# Altium project MainBoardPE2.PrjPcb
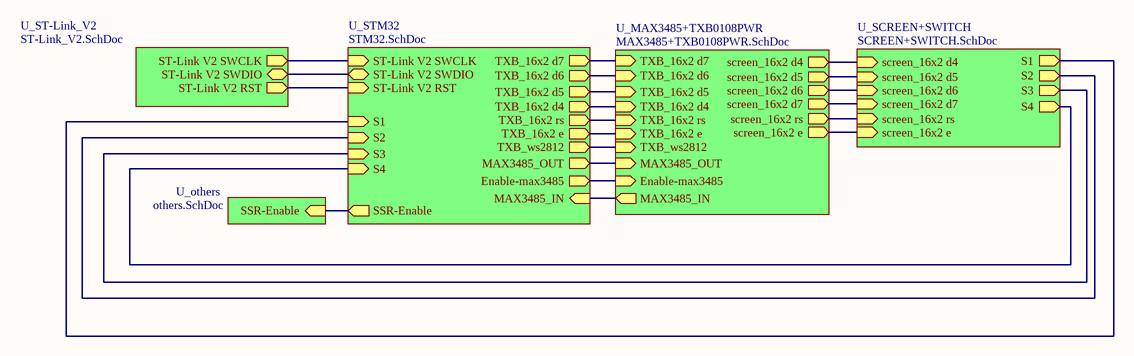
[diagram p0: TOP.SchDoc]
6 sheets, 40 parts. Net scope: hierarchical (ports join the sheet entries above them; power ports are global).
Board file: MainBoard.PcbDoc
Sheets:
  TOP.SchDoc
    U_STM32 = STM32.SchDoc
    U_ST-Link_V2 = ST-Link_V2.SchDoc
    U_SCREEN+SWITCH = SCREEN+SWITCH.SchDoc
    U_others = others.SchDoc
    U_MAX3485+TXB0108PWR = MAX3485+TXB0108PWR.SchDoc

## Sheet TOP.SchDoc
size A4; SheetNumber: 1; SheetTotal: 6

### Sub-sheets
U_MAX3485+TXB0108PWR = MAX3485+TXB0108PWR.SchDoc: Enable-max3485 (in), screen_16x2 d4 (out), screen_16x2 d5 (out), screen_16x2 d6 (out), screen_16x2 d7 (out), screen_16x2 rs (out), screen_16x2 e (out), TXB_16x2 d4 (in), TXB_16x2 d5 (in), TXB_16x2 d6 (in), TXB_16x2 d7 (in), TXB_16x2 rs (in), TXB_16x2 e (in), TXB_ws2812 (in), MAX3485_OUT (in), MAX3485_IN (out)
U_others = others.SchDoc: SSR-Enable (in)
U_SCREEN+SWITCH = SCREEN+SWITCH.SchDoc: screen_16x2 d4 (in), screen_16x2 d5 (in), screen_16x2 d6 (in), screen_16x2 d7 (in), screen_16x2 e (in), S4 (out), S1 (out), S2 (out), S3 (out), screen_16x2 rs (in)
U_ST-Link_V2 = ST-Link_V2.SchDoc: ST-Link V2 SWDIO (bidir), ST-Link V2 SWCLK (out), ST-Link V2 RST (out)
U_STM32 = STM32.SchDoc: ST-Link V2 SWCLK (in), ST-Link V2 SWDIO (bidir), TXB_16x2 d7 (out), ST-Link V2 RST (in), Enable-max3485 (out), TXB_16x2 d4 (out), TXB_16x2 d5 (out), TXB_16x2 d6 (out), TXB_16x2 rs (out), TXB_16x2 e (out), S2 (in), S3 (in), S4 (in), S1 (in), SSR-Enable (out), TXB_ws2812 (out), MAX3485_IN (in), MAX3485_OUT (out)

### Nets
NetH1_1: sheet U_STM32/ST-Link V2 RST, sheet U_ST-Link_V2/ST-Link V2 RST
NetH1_2: sheet U_STM32/ST-Link V2 SWDIO, sheet U_ST-Link_V2/ST-Link V2 SWDIO
NetH1_4: sheet U_STM32/ST-Link V2 SWCLK, sheet U_ST-Link_V2/ST-Link V2 SWCLK
NetIC1_12: sheet U_STM32/SSR-Enable, sheet U_others/SSR-Enable
NetIC1_13: sheet U_STM32/S1, sheet U_SCREEN+SWITCH/S1
NetIC1_14: sheet U_STM32/S2, sheet U_SCREEN+SWITCH/S2
NetIC1_15: sheet U_STM32/S3, sheet U_SCREEN+SWITCH/S3
NetIC1_16: sheet U_STM32/S4, sheet U_SCREEN+SWITCH/S4
NetIC1_30: sheet U_STM32/MAX3485_OUT, sheet U_MAX3485+TXB0108PWR/MAX3485_OUT
NetIC1_31: sheet U_STM32/MAX3485_IN, sheet U_MAX3485+TXB0108PWR/MAX3485_IN
NetIC1_32: sheet U_STM32/Enable-max3485, sheet U_MAX3485+TXB0108PWR/Enable-max3485
NetIC1_39: sheet U_STM32/TXB_ws2812, sheet U_MAX3485+TXB0108PWR/TXB_ws2812
NetIC1_40: sheet U_STM32/TXB_16x2 d7, sheet U_MAX3485+TXB0108PWR/TXB_16x2 d7
NetIC1_41: sheet U_STM32/TXB_16x2 d6, sheet U_MAX3485+TXB0108PWR/TXB_16x2 d6
NetIC1_42: sheet U_STM32/TXB_16x2 d5, sheet U_MAX3485+TXB0108PWR/TXB_16x2 d5
NetIC1_43: sheet U_STM32/TXB_16x2 d4, sheet U_MAX3485+TXB0108PWR/TXB_16x2 d4
NetIC1_45: sheet U_STM32/TXB_16x2 e, sheet U_MAX3485+TXB0108PWR/TXB_16x2 e
NetIC1_46: sheet U_STM32/TXB_16x2 rs, sheet U_MAX3485+TXB0108PWR/TXB_16x2 rs
NetIC3_13: sheet U_SCREEN+SWITCH/screen_16x2 d7, sheet U_MAX3485+TXB0108PWR/screen_16x2 d7
NetIC3_14: sheet U_SCREEN+SWITCH/screen_16x2 d6, sheet U_MAX3485+TXB0108PWR/screen_16x2 d6
NetIC3_15: sheet U_SCREEN+SWITCH/screen_16x2 d5, sheet U_MAX3485+TXB0108PWR/screen_16x2 d5
NetIC3_16: sheet U_SCREEN+SWITCH/screen_16x2 d4, sheet U_MAX3485+TXB0108PWR/screen_16x2 d4
NetIC3_17: sheet U_SCREEN+SWITCH/screen_16x2 e, sheet U_MAX3485+TXB0108PWR/screen_16x2 e
NetIC3_18: sheet U_SCREEN+SWITCH/screen_16x2 rs, sheet U_MAX3485+TXB0108PWR/screen_16x2 rs

## Sheet STM32.SchDoc
size A4; SheetNumber: 2; SheetTotal: 6
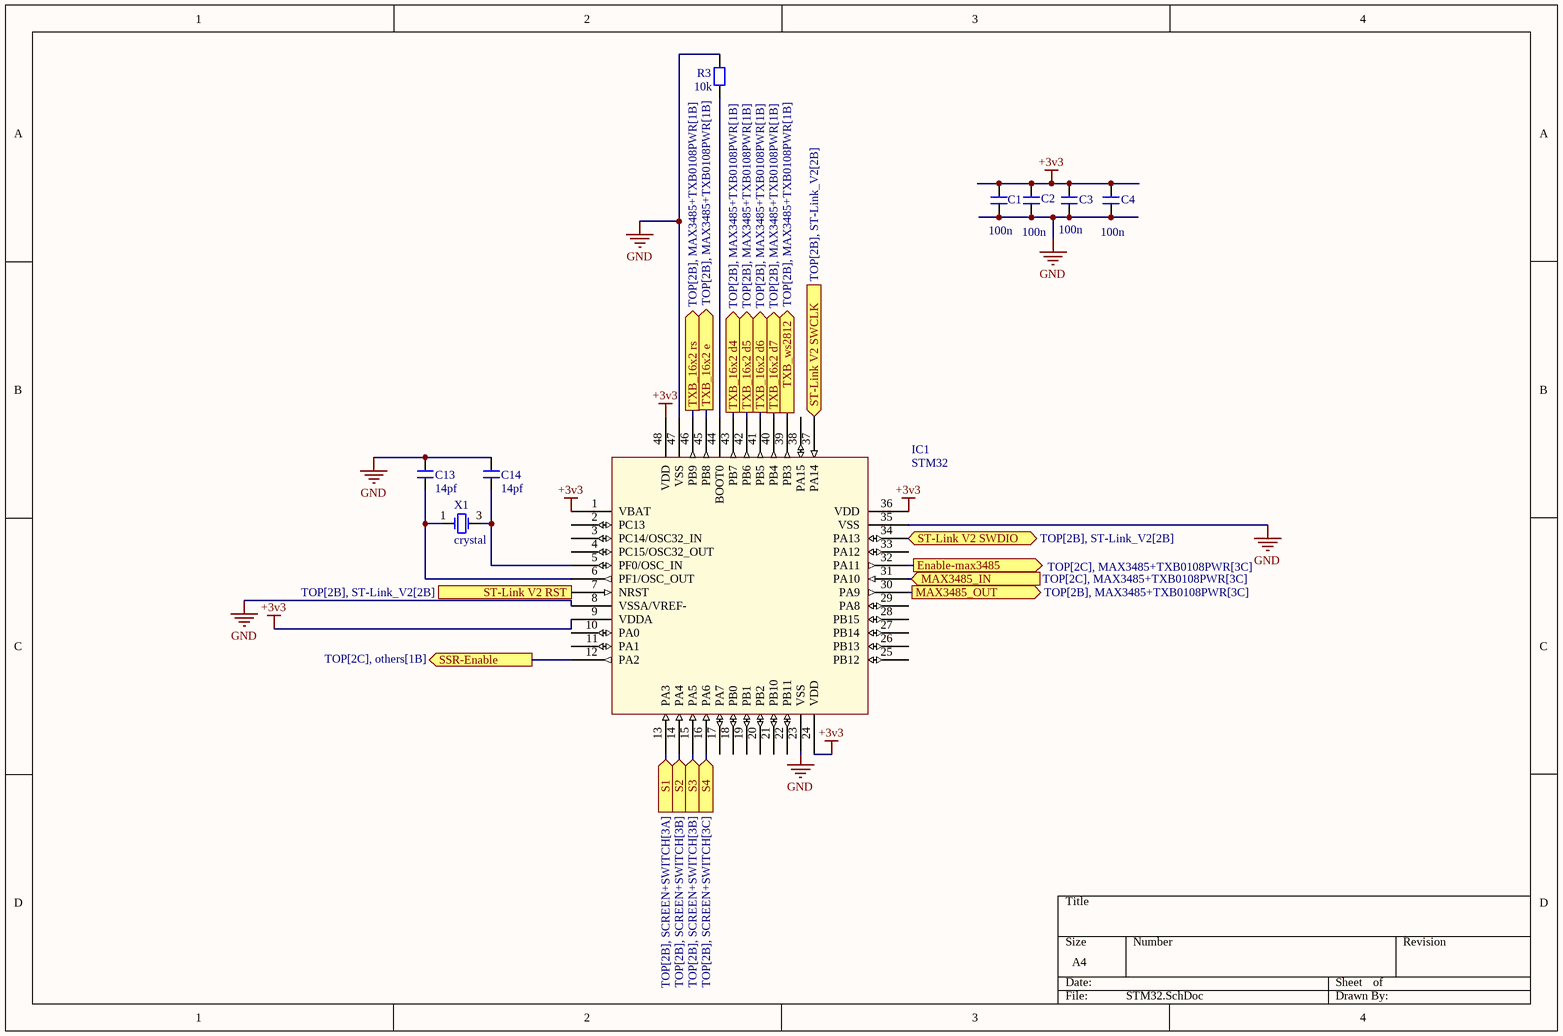
[diagram p1: STM32.SchDoc]

### Parts
C1  100n  [0805]
C2  100n  [0805]
C3  100n  [0805]
C4  100n  [0805]
C13  14pf  [0805]
C14  14pf  [0805]
IC1  STM32  [STM32]
R3  10k  [0805]
X1  crystal  [crystal]

### Ports
Enable-max3485 (out, see TOP[2C], MAX3485+TXB0108PWR[3C]), MAX3485_IN (in, see TOP[2C], MAX3485+TXB0108PWR[3C]), MAX3485_OUT (out, see TOP[2B], MAX3485+TXB0108PWR[3C]), S1 (in, see TOP[2B], SCREEN+SWITCH[3A]), S2 (in, see TOP[2B], SCREEN+SWITCH[3B]), S3 (in, see TOP[2B], SCREEN+SWITCH[3B]), S4 (in, see TOP[2B], SCREEN+SWITCH[3C]), SSR-Enable (out, see TOP[2C], others[1B]), ST-Link V2 RST (in, see TOP[2B], ST-Link_V2[2B]), ST-Link V2 SWCLK (in, see TOP[2B], ST-Link_V2[2B]), ST-Link V2 SWDIO (bidir, see TOP[2B], ST-Link_V2[2B]), TXB_16x2 d4 (out, see TOP[2B], MAX3485+TXB0108PWR[1B]), TXB_16x2 d5 (out, see TOP[2B], MAX3485+TXB0108PWR[1B]), TXB_16x2 d6 (out, see TOP[2B], MAX3485+TXB0108PWR[1B]), TXB_16x2 d7 (out, see TOP[2B], MAX3485+TXB0108PWR[1B]), TXB_16x2 e (out, see TOP[2B], MAX3485+TXB0108PWR[1B]), TXB_16x2 rs (out, see TOP[2B], MAX3485+TXB0108PWR[1B]), TXB_ws2812 (out, see TOP[2B], MAX3485+TXB0108PWR[1B])

### Nets
+3v3: C1.1 C2.1 C3.1 C4.1 IC1.1(VBAT) IC1.9(VDDA) IC1.24(VDD) IC1.36(VDD) IC1.48(VDD)
GND: C1.2 C2.2 C3.2 C4.2 C13.1 C14.1 IC1.8(VSSA/VREF-) IC1.23(VSS) IC1.35(VSS) IC1.47(VSS) R3.1
NetC13_2: C13.2 IC1.6(PF1/OSC_OUT) X1.1(OSC1)
NetC14_2: C14.2 IC1.5(PF0/OSC_IN) X1.3(OSC2)
NetH1_1: IC1.7(NRST) ; port ST-Link V2 RST
NetH1_2: IC1.34(PA13) ; port ST-Link V2 SWDIO
NetH1_4: IC1.37(PA14) ; port ST-Link V2 SWCLK
NetIC1_12: IC1.12(PA2) ; port SSR-Enable
NetIC1_13: IC1.13(PA3) ; port S1
NetIC1_14: IC1.14(PA4) ; port S2
NetIC1_15: IC1.15(PA5) ; port S3
NetIC1_16: IC1.16(PA6) ; port S4
NetIC1_30: IC1.30(PA9) ; port MAX3485_OUT
NetIC1_31: IC1.31(PA10) ; port MAX3485_IN
NetIC1_32: IC1.32(PA11) ; port Enable-max3485
NetIC1_39: IC1.39(PB3) ; port TXB_ws2812
NetIC1_40: IC1.40(PB4) ; port TXB_16x2 d7
NetIC1_41: IC1.41(PB5) ; port TXB_16x2 d6
NetIC1_42: IC1.42(PB6) ; port TXB_16x2 d5
NetIC1_43: IC1.43(PB7) ; port TXB_16x2 d4
NetIC1_44: IC1.44(BOOT0) R3.2
NetIC1_45: IC1.45(PB8) ; port TXB_16x2 e
NetIC1_46: IC1.46(PB9) ; port TXB_16x2 rs

Not connected (* = marked no-connect by the designer): IC1 2(PC13) 3(PC14/OSC32_IN) 4(PC15/OSC32_OUT) 10(PA0) 11(PA1) 17(PA7) 18(PB0) 19(PB1) 20(PB2) 21(PB10) 22(PB11) 25(PB12) 26(PB13) 27(PB14) 28(PB15) 29(PA8) 33(PA12) 38(PA15)

### Library data of the parts
C1-C4 C13 C14 = capacitor
R3 = resistor

## Sheet ST-Link_V2.SchDoc
size A4; SheetNumber: 3; SheetTotal: 6
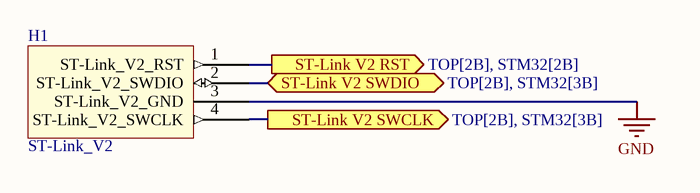
[diagram p2: ST-Link_V2.SchDoc]

### Parts
H1  ST-Link_V2  [4pin]

### Ports
ST-Link V2 RST (out, see TOP[2B], STM32[2B]), ST-Link V2 SWCLK (out, see TOP[2B], STM32[3B]), ST-Link V2 SWDIO (bidir, see TOP[2B], STM32[3B])

### Nets
GND: H1.3(ST-Link_V2_GND)
NetH1_1: H1.1(ST-Link_V2_RST) ; port ST-Link V2 RST
NetH1_2: H1.2(ST-Link_V2_SWDIO) ; port ST-Link V2 SWDIO
NetH1_4: H1.4(ST-Link_V2_SWCLK) ; port ST-Link V2 SWCLK

## Sheet SCREEN+SWITCH.SchDoc
size A4; SheetNumber: 5; SheetTotal: 6
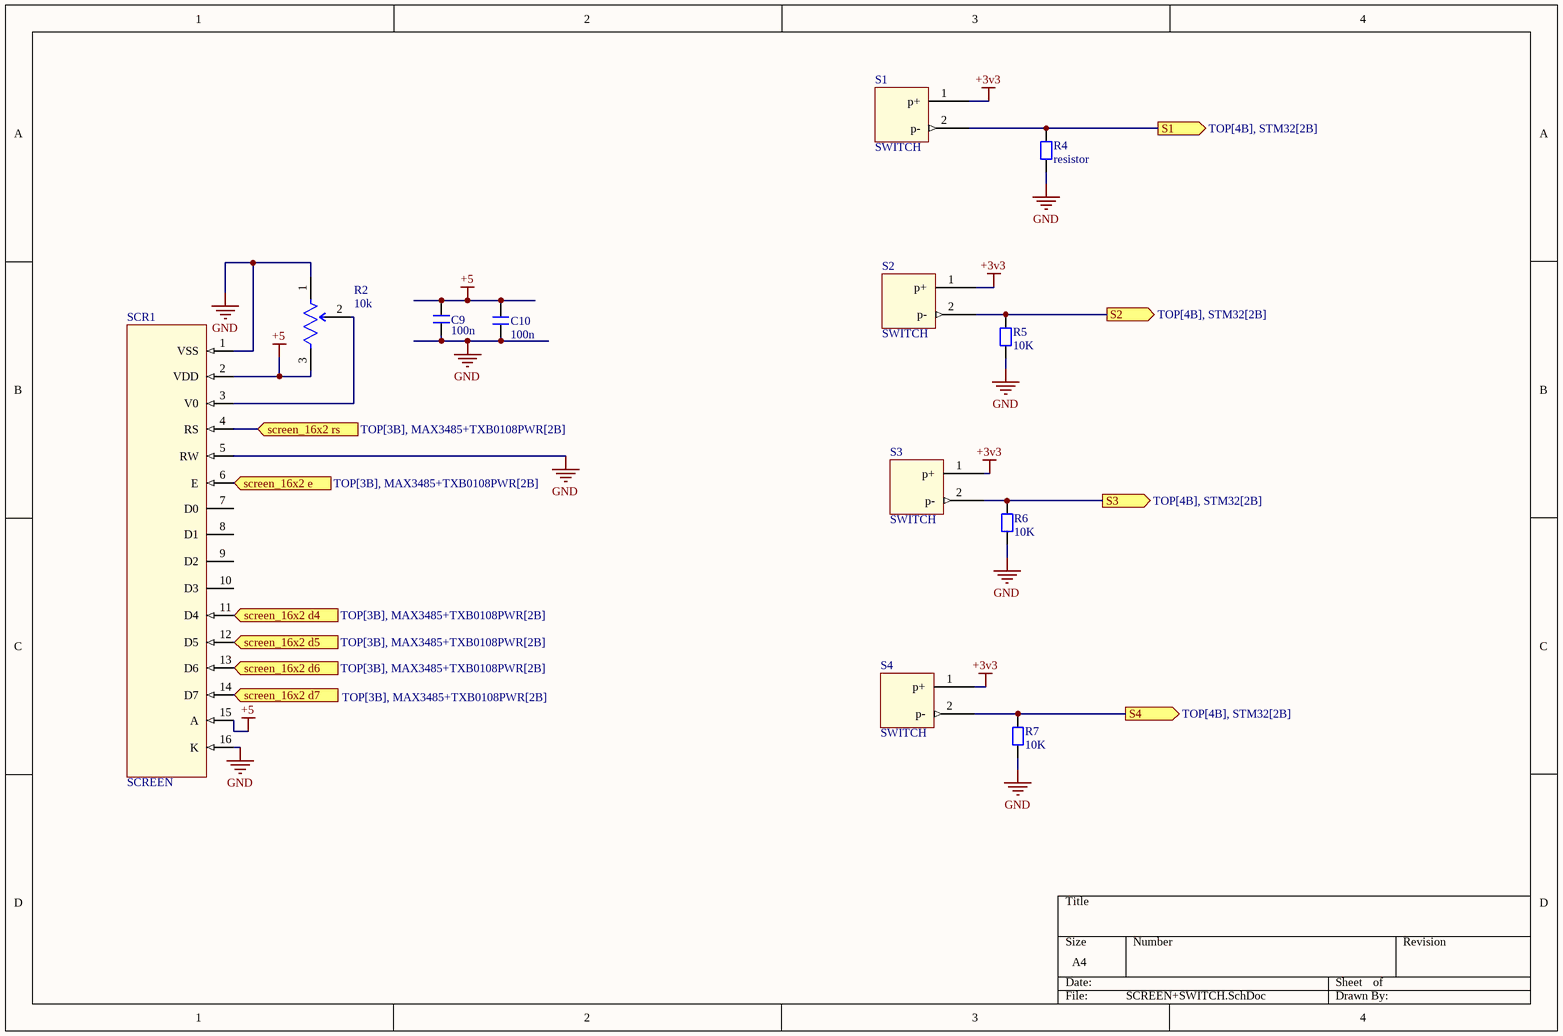
[diagram p3: SCREEN+SWITCH.SchDoc]

### Parts
C9  100n  [0805]
C10  100n  [0805]
R2  10k  [potentiometer]
R4  resistor  [0805]
R5  10K  [0805]
R6  10K  [0805]
R7  10K  [0805]
S1  SWITCH  [SWITCh]
S2  SWITCH  [SWITCh]
S3  SWITCH  [SWITCh]
S4  SWITCH  [SWITCh]
SCR1  SCREEN  [SCREEN]

### Ports
S1 (out, see TOP[4B], STM32[2B]), S2 (out, see TOP[4B], STM32[2B]), S3 (out, see TOP[4B], STM32[2B]), S4 (out, see TOP[4B], STM32[2B]), screen_16x2 d4 (in, see TOP[3B], MAX3485+TXB0108PWR[2B]), screen_16x2 d5 (in, see TOP[3B], MAX3485+TXB0108PWR[2B]), screen_16x2 d6 (in, see TOP[3B], MAX3485+TXB0108PWR[2B]), screen_16x2 d7 (in, see TOP[3B], MAX3485+TXB0108PWR[2B]), screen_16x2 e (in, see TOP[3B], MAX3485+TXB0108PWR[2B]), screen_16x2 rs (in, see TOP[3B], MAX3485+TXB0108PWR[2B])

### Nets
+3v3: S1.1(p+) S2.1(p+) S3.1(p+) S4.1(p+)
+5: C9.1 C10.1 R2.3(CW) SCR1.2(VDD) SCR1.15(A)
GND: C9.2 C10.2 R2.1(CCW) R4.2 R5.2 R6.2 R7.2 SCR1.1(VSS) SCR1.5(RW) SCR1.16(K)
NetIC1_13: R4.1 S1.2(p-) ; port S1
NetIC1_14: R5.1 S2.2(p-) ; port S2
NetIC1_15: R6.1 S3.2(p-) ; port S3
NetIC1_16: R7.1 S4.2(p-) ; port S4
NetIC3_13: SCR1.14(D7) ; port screen_16x2 d7
NetIC3_14: SCR1.13(D6) ; port screen_16x2 d6
NetIC3_15: SCR1.12(D5) ; port screen_16x2 d5
NetIC3_16: SCR1.11(D4) ; port screen_16x2 d4
NetIC3_17: SCR1.6(E) ; port screen_16x2 e
NetIC3_18: SCR1.4(RS) ; port screen_16x2 rs
NetR2_2: R2.2(WIPER) SCR1.3(V0)

Not connected (* = marked no-connect by the designer): SCR1 7(D0) 8(D1) 9(D2) 10(D3)

### Library data of the parts
C9 C10 = capacitor
R2 = potentiometer
R5-R7 = resistor

## Sheet others.SchDoc
size A4; SheetNumber: 6; SheetTotal: 6
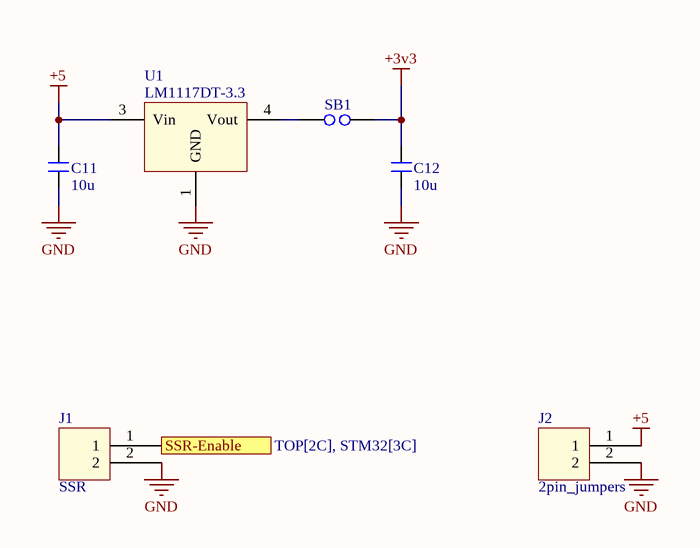
[diagram p4: others.SchDoc]

### Parts
C11  10u  [0805]
C12  10u  [0805]
J1  SSR  [2pin]
J2  2pin_jumpers  [2pinpwd]
SB1  SolderBrige  [SolderBrige]  (value not drawn)
U1  LM1117DT-3.3  [LM1117DT-3.3]

### Ports
SSR-Enable (in, see TOP[2C], STM32[3C])

### Nets
+3v3: C12.1 SB1.1
+5: C11.1 J2.1 U1.3(Vin)
GND: C11.2 C12.2 J1.2 J2.2 U1.1(GND)
NetIC1_12: J1.1 ; port SSR-Enable
NetSB1_2: SB1.2 U1.4(Vout)

### Library data of the parts
C11 C12 = capacitor

## Sheet MAX3485+TXB0108PWR.SchDoc
size A4; SheetNumber: 4; SheetTotal: 6
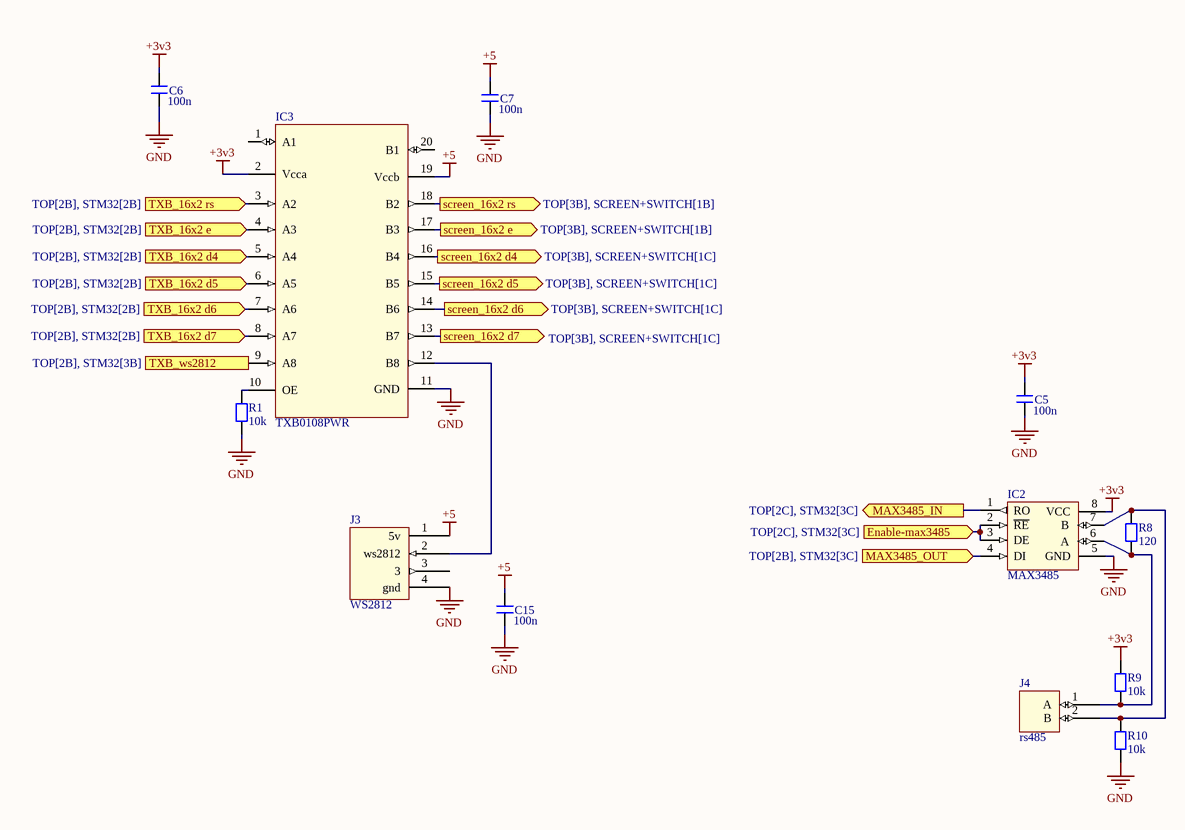
[diagram p5: MAX3485+TXB0108PWR.SchDoc]

### Parts
C5  100n  [0805]
C6  100n  [0805]
C7  100n  [0805]
C15  100n  [0805]
IC2  MAX3485  [MAX3485]
IC3  TXB0108PWR  [TXB0108PWR]
J3  WS2812  [4pinpwd]
J4  rs485  [2pin]
R1  10k  [0805]
R8  120  [0805]
R9  10k  [0805]
R10  10k  [0805]

### Ports
Enable-max3485 (in, see TOP[2C], STM32[3C]), MAX3485_IN (out, see TOP[2C], STM32[3C]), MAX3485_OUT (in, see TOP[2B], STM32[3C]), screen_16x2 d4 (out, see TOP[3B], SCREEN+SWITCH[1C]), screen_16x2 d5 (out, see TOP[3B], SCREEN+SWITCH[1C]), screen_16x2 d6 (out, see TOP[3B], SCREEN+SWITCH[1C]), screen_16x2 d7 (out, see TOP[3B], SCREEN+SWITCH[1C]), screen_16x2 e (out, see TOP[3B], SCREEN+SWITCH[1B]), screen_16x2 rs (out, see TOP[3B], SCREEN+SWITCH[1B]), TXB_16x2 d4 (in, see TOP[2B], STM32[2B]), TXB_16x2 d5 (in, see TOP[2B], STM32[2B]), TXB_16x2 d6 (in, see TOP[2B], STM32[2B]), TXB_16x2 d7 (in, see TOP[2B], STM32[2B]), TXB_16x2 e (in, see TOP[2B], STM32[2B]), TXB_16x2 rs (in, see TOP[2B], STM32[2B]), TXB_ws2812 (in, see TOP[2B], STM32[3B])

### Nets
+3v3: C5.1 C6.1 IC2.8(VCC) IC3.2(Vcca) R9.1
+5: C7.1 C15.1 IC3.19(Vccb) J3.1(5v)
GND: C5.2 C6.2 C7.2 C15.2 IC2.5(GND) IC3.11(GND) J3.4(gnd) R1.2 R10.2
NetIC1_30: IC2.4(DI) ; port MAX3485_OUT
NetIC1_31: IC2.1(RO) ; port MAX3485_IN
NetIC1_32: IC2.2(~{RE}) IC2.3(DE) ; port Enable-max3485
NetIC1_39: IC3.9(A8) ; port TXB_ws2812
NetIC1_40: IC3.8(A7) ; port TXB_16x2 d7
NetIC1_41: IC3.7(A6) ; port TXB_16x2 d6
NetIC1_42: IC3.6(A5) ; port TXB_16x2 d5
NetIC1_43: IC3.5(A4) ; port TXB_16x2 d4
NetIC1_45: IC3.4(A3) ; port TXB_16x2 e
NetIC1_46: IC3.3(A2) ; port TXB_16x2 rs
NetIC2_6: IC2.6(A) J4.1(A) R8.2 R9.2
NetIC2_7: IC2.7(B) J4.2(B) R8.1 R10.1
NetIC3_10: IC3.10(OE) R1.1
NetIC3_12: IC3.12(B8) J3.2(ws2812)
NetIC3_13: IC3.13(B7) ; port screen_16x2 d7
NetIC3_14: IC3.14(B6) ; port screen_16x2 d6
NetIC3_15: IC3.15(B5) ; port screen_16x2 d5
NetIC3_16: IC3.16(B4) ; port screen_16x2 d4
NetIC3_17: IC3.17(B3) ; port screen_16x2 e
NetIC3_18: IC3.18(B2) ; port screen_16x2 rs

Not connected (* = marked no-connect by the designer): IC3 1(A1) 20(B1); J3 3

### Library data of the parts
C5-C7 C15 = capacitor
R1 R8-R10 = resistor

## Nets that join several sheets
+3v3: STM32 (9 pins), SCREEN+SWITCH (S1.1 S2.1 S3.1 S4.1), others (C12.1 SB1.1), MAX3485+TXB0108PWR (5 pins)
+5: SCREEN+SWITCH (5 pins), others (C11.1 J2.1 U1.3), MAX3485+TXB0108PWR (C7.1 C15.1 IC3.19 J3.1)
GND: STM32 (11 pins), ST-Link_V2 (H1.3), SCREEN+SWITCH (10 pins), others (5 pins), MAX3485+TXB0108PWR (9 pins)
NetH1_1: STM32 (IC1.7), ST-Link_V2 (H1.1)
NetH1_2: STM32 (IC1.34), ST-Link_V2 (H1.2)
NetH1_4: STM32 (IC1.37), ST-Link_V2 (H1.4)
NetIC1_12: STM32 (IC1.12), others (J1.1)
NetIC1_13: STM32 (IC1.13), SCREEN+SWITCH (R4.1 S1.2)
NetIC1_14: STM32 (IC1.14), SCREEN+SWITCH (R5.1 S2.2)
NetIC1_15: STM32 (IC1.15), SCREEN+SWITCH (R6.1 S3.2)
NetIC1_16: STM32 (IC1.16), SCREEN+SWITCH (R7.1 S4.2)
NetIC1_30: STM32 (IC1.30), MAX3485+TXB0108PWR (IC2.4)
NetIC1_31: STM32 (IC1.31), MAX3485+TXB0108PWR (IC2.1)
NetIC1_32: STM32 (IC1.32), MAX3485+TXB0108PWR (IC2.2 IC2.3)
NetIC1_39: STM32 (IC1.39), MAX3485+TXB0108PWR (IC3.9)
NetIC1_40: STM32 (IC1.40), MAX3485+TXB0108PWR (IC3.8)
NetIC1_41: STM32 (IC1.41), MAX3485+TXB0108PWR (IC3.7)
NetIC1_42: STM32 (IC1.42), MAX3485+TXB0108PWR (IC3.6)
NetIC1_43: STM32 (IC1.43), MAX3485+TXB0108PWR (IC3.5)
NetIC1_45: STM32 (IC1.45), MAX3485+TXB0108PWR (IC3.4)
NetIC1_46: STM32 (IC1.46), MAX3485+TXB0108PWR (IC3.3)
NetIC3_13: SCREEN+SWITCH (SCR1.14), MAX3485+TXB0108PWR (IC3.13)
NetIC3_14: SCREEN+SWITCH (SCR1.13), MAX3485+TXB0108PWR (IC3.14)
NetIC3_15: SCREEN+SWITCH (SCR1.12), MAX3485+TXB0108PWR (IC3.15)
NetIC3_16: SCREEN+SWITCH (SCR1.11), MAX3485+TXB0108PWR (IC3.16)
NetIC3_17: SCREEN+SWITCH (SCR1.6), MAX3485+TXB0108PWR (IC3.17)
NetIC3_18: SCREEN+SWITCH (SCR1.4), MAX3485+TXB0108PWR (IC3.18)